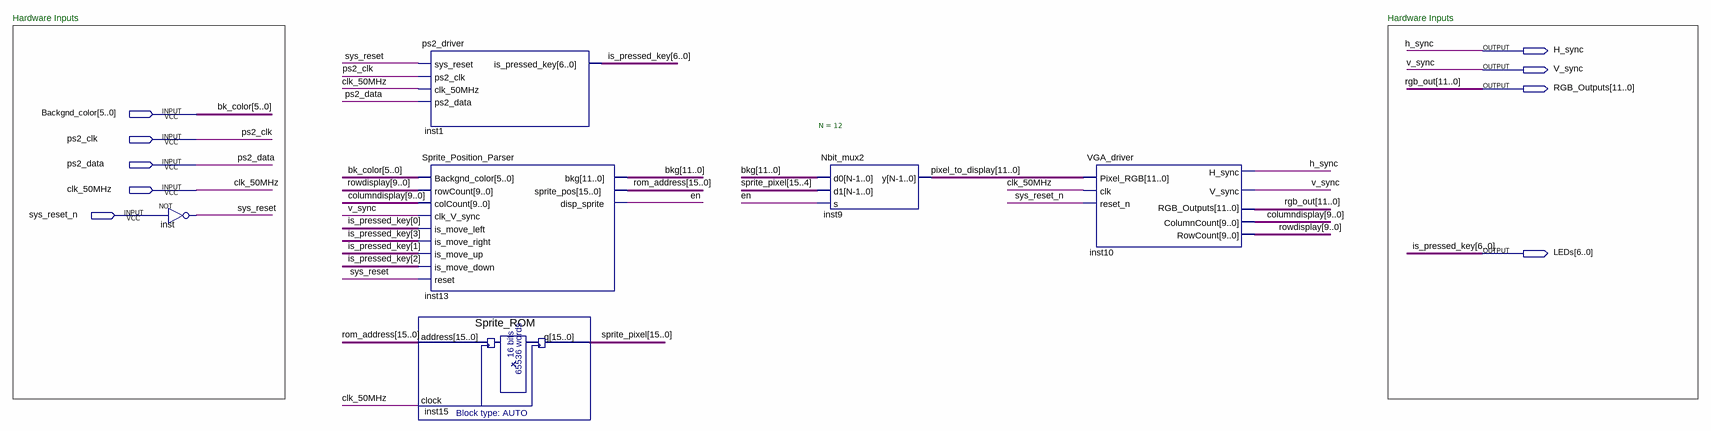
[diagram p0: schematic sheet]
// Quartus schematic keyboard_controlled_sprite.bdf as structural Verilog: 6 symbols, 9 pins
module keyboard_controlled_sprite (
  input  [5:0] Backgnd_color,
  input  ps2_clk,
  input  ps2_data,
  input  clk_50MHz,
  input  sys_reset_n,
  output H_sync,
  output V_sync,
  output [11:0] RGB_Outputs,
  output [6:0] LEDs
);

  wire en, sys_reset;
  wire [9:0] columndisplay, rowdisplay;
  wire [11:0] bkg, pixel_to_display;
  wire [15:0] rom_address, sprite_pixel;

  not inst (sys_reset, sys_reset_n);
  ps2_driver inst1 (
    .sys_reset(sys_reset), .ps2_clk(ps2_clk), .clk_50MHz(clk_50MHz), .ps2_data(ps2_data),
    .is_pressed_key(LEDs));
  Sprite_Position_Parser inst13 (
    .Backgnd_color(Backgnd_color), .reset(sys_reset), .rowCount(rowdisplay), .colCount(columndisplay),
    .clk_V_sync(V_sync), .is_move_left(LEDs[0]), .is_move_right(LEDs[3]), .is_move_up(LEDs[1]),
    .is_move_down(LEDs[2]), .bkg(bkg), .sprite_pos(rom_address), .disp_sprite(en));
  Sprite_ROM inst15 (.address(rom_address), .clock(clk_50MHz), .q(sprite_pixel));
  Nbit_mux2 #(.N(12)) inst9 (.d0(bkg), .d1(sprite_pixel[15:4]), .s(en), .y(pixel_to_display));
  VGA_driver inst10 (
    .reset_n(sys_reset_n), .clk(clk_50MHz), .Pixel_RGB(pixel_to_display), .H_sync(H_sync), .V_sync(V_sync),
    .ColumnCount(columndisplay), .RGB_Outputs(RGB_Outputs), .RowCount(rowdisplay));

  // Other names for the same wires on the sheet: bk_color[5:0] = Backgnd_color; is_pressed_key[6:0] = LEDs;
  //   rgb_out[11:0] = RGB_Outputs

  // Notes on the sheet:
  //   Hardware Inputs
  //   Hardware Inputs
endmodule
